# Altium project humidity sensor.PrjPcb
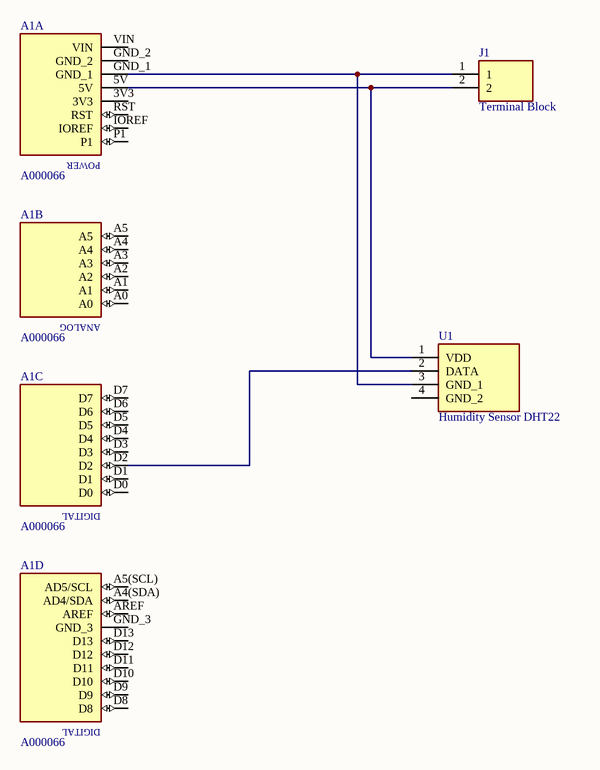
[diagram p0: humidity sensor.SchDoc]
1 sheet, 3 parts. Net scope: global (net labels, ports and power ports of the same name join across sheets).
Board file: humidity sensor.PcbDoc

## Sheet humidity sensor.SchDoc
size A4; SheetNumber: 1; SheetTotal: 1

### Parts
A1  A000066  [ARDUINO_A000066]  (parts A,B,C,D of 4)
J1  Terminal Block  [TB00250002BE]
U1  Humidity Sensor DHT22  [314010001]

### Nets
NetA1_5V: A1.5V J1.2 U1.1(VDD)
NetA1_D2: A1.D2 U1.2(DATA)
NetA1_GND_1: A1.GND_1 J1.1 U1.3(GND_1)

Not connected (* = marked no-connect by the designer): A1 3V3 A0 A1 A2 A3 A4 A4(SDA)(AD4/SDA) A5 A5(SCL)(AD5/SCL) AREF D0 D1 D3 D4 D5 D6 D7 D8 D9 D10 D11 D12 D13 GND_2 GND_3 IOREF P1 RST VIN; U1 4(GND_2)

### Notes on the sheet
- (in symbol A000066, part A) POWER
- (in symbol A000066, part B) ANALOG
- (in symbol A000066, part C) DIGITAL
- (in symbol A000066, part D) DIGITAL

### Library data of the parts
A1 = A000066: Microcontroller board, Uno [Arduino] A000066 Microcontroller board, Uno 7640152110092 <a href="https://pricing.snapeda.com/parts/A000066/Arduino/view-part?ref=eda">Check prices</a> <a href="https://pricing.snapeda.com/parts/A000066/Arduino/view-part?ref=eda">Check prices</a>; pin to pad: A4(SDA)>A4(SDA; MF: {'manufacturer': u'Arduino'}; MP: ARDUINO UNO REV3; Package: None; Price: None; Value: *; Availability: Unavailable
J1 = TB002-500-02BE: Connector; Manufacturer_Name: CUI Devices; Datasheet Link: https://eu.mouser.com/datasheet/2/670/tb002_500-1550579.pdf; Height: 10.4mm; Manufacturer_Part_Number: TB002-500-02BE; Mouser Part Number: 490-TB002-500-02BE; Mouser Price/Stock: https://www.mouser.co.uk/ProductDetail/CUI-Devices/TB002-500-02BE?qs=vLWxofP3U2x9716kcgva%2Fw%3D%3D; Arrow Part Number: TB002-500-02BE; Arrow Price/Stock: https://www.arrow.com/en/products/tb002-500-02be/cui-devices?region=nac
U1 = 314010001: Manufacturer_Name: Seeed Studio; Datasheet Link: https://cdn-shop.adafruit.com/datasheets/Digital+humidity+and+temperature+sensor+AM2302.pdf; Height: 25.1mm; Manufacturer_Part_Number: 314010001; Mouser Part Number: 713-314010001; Mouser Price/Stock: https://www.mouser.co.uk/ProductDetail/Seeed-Studio/314010001?qs=XeJtXLiO41Rct75wpr%2Fpbg%3D%3D